# Altium project RadiationDetector.PrjPcb (part 2 of 5)

## Sheet Scintillator_Circuit.SchDoc
size A4; CheckedBy: Sr. Andrés Roldán; Address1: Avda. Madrid 28, Edif. I+D Josefina Castro Vizoso,  2ª planta 18012 - GRANADA, SPAIN; SheetNumber: 3; SheetTotal: 6
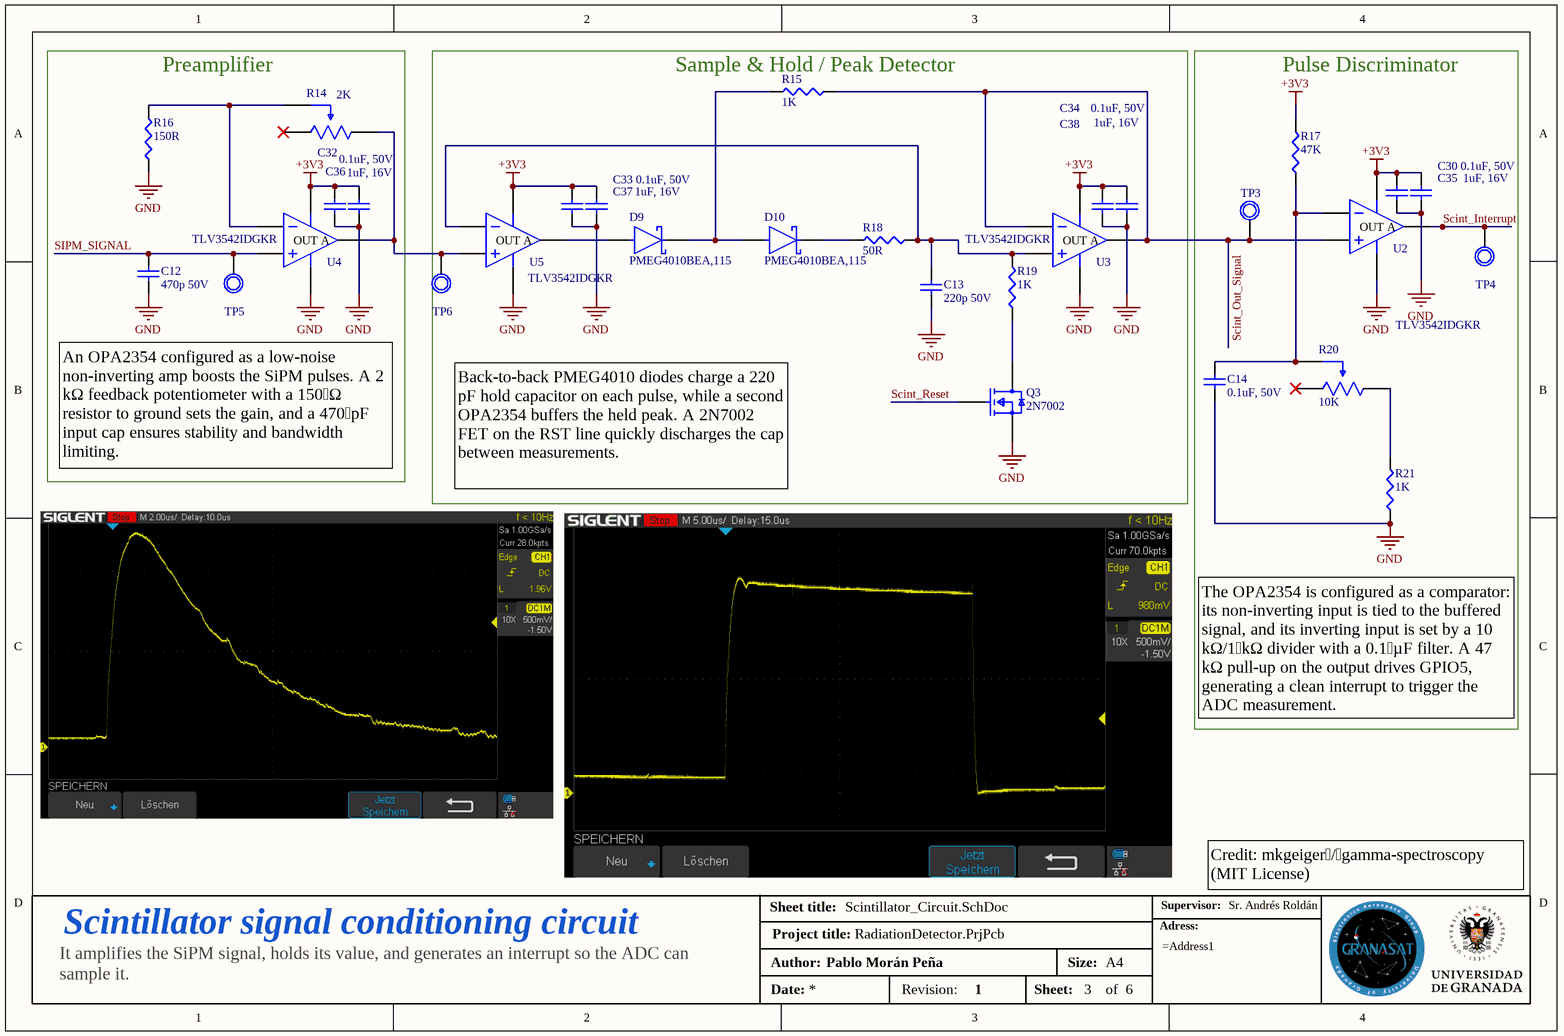
[diagram p2: Scintillator_Circuit.SchDoc]

### Parts
C12  470p 50V  [CAP 0402_1005]
C13  220p 50V  [CAP 0402_1005]
C14  0.1uF, 50V  [CAP 0402_1005]
C30  0.1uF, 50V  [CAP 0402_1005]
C32  0.1uF, 50V  [CAP 0402_1005]
C33  0.1uF, 50V  [CAP 0402_1005]
C34  0.1uF, 50V  [CAP 0402_1005]
C35  1uF, 16V  [CAP 0402_1005]
C36  1uF, 16V  [CAP 0402_1005]
C37  1uF, 16V  [CAP 0402_1005]
C38  1uF, 16V  [CAP 0402_1005]
D9  PMEG4010BEA,115  [SOD2512X110N]
D10  PMEG4010BEA,115  [SOD2512X110N]
Q3  2N7002  [SOT95P240X111-3N]
R14  2K  [TRIM_3314J-1-202E]
R15  1K  [RESC1005X37N]
R16  150R  [RESC1005X37N]
R17  47K  [RESC1005X37N]
R18  50R  [RESC1005X37N]
R19  1K  [RESC1005X37N]
R20  10K  [TS53YL_VIS]
R21  1K  [RESC1005X37N]
TP3  Testpoint  [Testpoint]  (value not drawn)  (no BOM)
TP4  Testpoint  [Testpoint]  (value not drawn)  (no BOM)
TP5  Testpoint  [Testpoint]  (value not drawn)  (no BOM)
TP6  Testpoint  [Testpoint]  (value not drawn)  (no BOM)
U2  TLV3542IDGKR  [DGK0008A_M]
U3  TLV3542IDGKR  [DGK0008A_M]
U4  TLV3542IDGKR  [DGK0008A_M]
U5  TLV3542IDGKR  [DGK0008A_M]

### Blocks framed on the sheet
Preamplifier: C12 C32 C36 R14 R16 TP5 U4
Sample & Hold / Peak Detector: C13 C33 C34 C37 C38 D9 D10 Q3 R15 R18 R19 TP6 U3 U5
Pulse Discriminator: C14 C30 C35 R17 R20 R21 TP3 TP4 U2

### Nets
+3V3: C30.2 C32.2 C33.2 C34.2 C35.2 C36.2 C37.2 C38.2 R17.2 U2.7(V+) U3.7(V+) U4.7(V+) U5.7(V+)
GND: C12.1 C13.1 C14.1 C30.1 C32.1 C33.1 C34.1 C35.1 C36.1 C37.1 C38.1 Q3.2(S) R16.1 R21.1 U2.4(V-) U3.4(V-) U4.4(V-) U5.4(V-)
Scint_Interrupt: TP4.1 U2.6(OUT_A)
Scint_Out_Signal: R15.2 TP3.1 U2.3(IN_A+) U3.2(IN_A-) U3.6(OUT_A)
Scint_Reset: Q3.1(G)
SIPM_SIGNAL: C12.2 TP5.1 U4.3(IN_A+)
NetC13_2: C13.2 R18.2 R19.2 U3.3(IN_A+) U5.2(IN_A-)
NetC14_2: C14.2 R17.1 R20.2(WIPER) U2.2(IN_A-)
NetD9_1: D9.1(C) D10.2(A) R15.1
NetD9_2: D9.2(A) U5.6(OUT_A)
NetD10_1: D10.1(C) R18.1
NetQ3_3: Q3.3(D) R19.1
NetR14_2: R14.2(WIPER) R16.2 U4.2(IN_A-)
NetR14_3: R14.3(CW) TP6.1 U4.6(OUT_A) U5.3(IN_A+)
NetR20_3: R20.3(CW) R21.2

Not connected (* = marked no-connect by the designer): R14 1(CCW)*; R20 1(CCW)*

### Notes on the sheet
- An OPA2354 configured as a low‑noise non‑inverting amp boosts the SiPM pulses. A 2 kΩ feedback potentiometer with a 150 Ω resistor to ground sets the gain, and a 470 pF input cap ensures stability and bandwidth limiting.
- Back‑to‑back PMEG4010 diodes charge a 220 pF hold capacitor on each pulse, while a second OPA2354 buffers the held peak. A 2N7002 FET on the RST line quickly discharges the cap between measurements.
- The OPA2354 is configured as a comparator: its non‑inverting input is tied to the buffered signal, and its inverting input is set by a 10 kΩ/1 kΩ divider with a 0.1 µF filter. A 47 kΩ pull‑up on the output drives GPIO5, generating a clean interrupt to trigger the ADC measurement.
- Sheet title:
- Supervisor:
- Credit: mkgeiger / gamma‑spectroscopy (MIT License)
- Scintillator signal conditioning circuit
- Author:
- Project title:
- Size:
- A4
- Adress:
- It amplifies the SiPM signal, holds its value, and generates an interrupt so the ADC can sample it.
- Date:
- Revision:
- Sheet:
- of

### Library data of the parts
C12 = CL05B471KB5VPNC: CAP CER 470PF 50V X7R 0402; Manufacturer: Samsung; Dielectric Material: Ceramic; Multilayer: Yes; Tolerance  (fill in as +-): 10%; Reference Standard: AEC-Q200; Supplier: Digikey; Supplier Part Number: 1276-6586-1-ND; Manufacturer Part Number: CL05B471KB5VPNC; RoHS: Yes; Category: Ceramic Capacitors; Stock: 5716; Pricing: 1=0,1, 10=0,031, 100=0,0179, 1000=0,01119, 2500=0,00885, 5000=0,00853 (USD); Mounting Technology: Surface Mount; Pins: 2; Package Shape: Rectangular; Case/Package: 0402; Terminal Finish: Nickel; Min Operating Temperature: -55°C; Max Operating Temperature: 125°C; JESD-609 Code: e3; Value: 470pF; Capacitor Type: Ceramic; Packaging: Tape and Reel; Tolerance (fill in as +-): 10%; Rated DC Voltage (URdc): 50V; Temperature Characteristics Code: X7R; Termination: Wraparound; Reach SVHC Compliant: Yes; RoHS Compliant: Yes; ComponentLink1URL: https://datasheet.ciiva.com:443/pdfs/VipMasterIC/IC/SEMS/SEMS-S-A0005596039/SEMS-S-A0005588397-1.pdf?src-supplier=IHS+Markit; ComponentLink1Description: https://datasheet.ciiva.com:443/pdfs/VipMasterIC/IC/SEMS/SEMS-S-A0005596039/SEMS-S-A0005588397-1.pdf?src-supplier=IHS+Markit; ComponentLink2URL: http://www.samsungsem.com/kr/support/product-search/mlcc/CL05B471KB5VPNC.jsp?src-supplier=Digikey; ComponentLink2Description: http://www.samsungsem.com/kr/support/product-search/mlcc/CL05B471KB5VPNC.jsp?src-supplier=Digikey; ComponentLink3URL: http://www.samsungsem.com/servlet/FileDownload?type=spec&file=CL05B471KB5VPNC.pdf&src-supplier=Avnet; ComponentLink3Description: http://www.samsungsem.com/servlet/FileDownload?type=spec&file=CL05B471KB5VPNC.pdf&src-supplier=Avnet; ComponentLink4URL: https://datasheet.octopart.com/CL05B471KB5VPNC-Samsung-Electro-Mechanics-datasheet-110326788.pdf?src-supplier=Future+Electronics; ComponentLink4Description: https://datasheet.octopart.com/CL05B471KB5VPNC-Samsung-Electro-Mechanics-datasheet-110326788.pdf?src-supplier=Future+Electronics; LCSC Part Number: C472438
C13 = CL05B221KB5NNNC: CAP CER 220PF 50V X7R 0402; Manufacturer: Samsung; Dielectric Material: Ceramic; Multilayer: Yes; Tolerance  (fill in as +-): 10%; Supplier: Digikey; Supplier Part Number: 1276-1531-1-ND; Manufacturer Part Number: CL05B221KB5NNNC; RoHS: Yes; Category: Ceramic Capacitors; Stock: 59270; Pricing: 1=0,1, 10=0,019, 100=0,0104, 1000=0,00621, 2500=0,00466, 5000=0,00442 (USD); Mounting Technology: Surface Mount; Pins: 2; Package Shape: Rectangular; Case/Package: 0402; Terminal Finish: Nickel; Min Operating Temperature: -55°C; Max Operating Temperature: 125°C; JESD-609 Code: e3; Value: 220pF; Capacitor Type: Ceramic; Package Style: SMTMeter; Packaging: Tape and Reel; Tolerance (fill in as +-): 10%; Rated DC Voltage (URdc): 50V; Temperature Characteristics Code: X7R; Termination: Wraparound; Length: 1mm; Width: 0.5mm; Height: 0.55mm; Reach SVHC Compliant: Yes; RoHS Compliant: Yes; ComponentLink1URL: https://datasheet.ciiva.com:443/pdfs/VipMasterIC/IC/SEMS/SEMS-S-A0008384515/SEMS-S-A0008872887-1.pdf?src-supplier=IHS+Markit; ComponentLink1Description: https://datasheet.ciiva.com:443/pdfs/VipMasterIC/IC/SEMS/SEMS-S-A0008384515/SEMS-S-A0008872887-1.pdf?src-supplier=IHS+Markit; ComponentLink2URL: https://datasheet.ciiva.com/25806/cl05b221kb5nnnc-25806724.pdf?src-supplier=Digikey; ComponentLink2Description: https://datasheet.ciiva.com/25806/cl05b221kb5nnnc-25806724.pdf?src-supplier=Digikey; ComponentLink3URL: https://datasheet.ciiva.com/26838/getdatasheetpartid-359684-26838219.pdf?src-supplier=Verical; ComponentLink3Description: https://datasheet.ciiva.com/26838/getdatasheetpartid-359684-26838219.pdf?src-supplier=Verical; ComponentLink4URL: https://datasheet.ciiva.com/16449/cl05b221kb5nnnc-16449133.pdf?src-supplier=Future+Electronics; ComponentLink4Description: https://datasheet.ciiva.com/16449/cl05b221kb5nnnc-16449133.pdf?src-supplier=Future+Electronics; ComponentLink5URL: https://datasheet.ciiva.com/26309/mlcc-catalogdownload2013-eng-26309018.pdf?src-supplier=Distrelec; ComponentLink5Description: https://datasheet.ciiva.com/26309/mlcc-catalogdownload2013-eng-26309018.pdf?src-supplier=Distrelec; LCSC Part Number: C296710
C14 C30 C32-C34 = CL05B104KB5NNNC: CAP CER 0.1UF 50V X7R 0402; Manufacturer: Samsung; Dielectric Material: Ceramic; Value: 100nF; Multilayer: Yes; Tolerance  (fill in as +-): 10%; Supplier: Avnet; Supplier Part Number: CL05B104KB5NNNC; Manufacturer Part Number: CL05B104KB5NNNC; RoHS: Yes; Category: Ceramic Capacitors; Pricing: 100000=0,00598, 120000=0,00595, 220000=0,00592, 500000=0,00589, 1000000=0,00586 (USD); Mounting Technology: Surface Mount; Pins: 2; Package Shape: Rectangular; Case/Package: 0402; Terminal Finish: Nickel; Min Operating Temperature: -55°C; Max Operating Temperature: 125°C; JESD-609 Code: e3; Capacitor Type: Ceramic; Packaging: Tape and Reel; Tolerance (fill in as +-): 10%; Rated DC Voltage (URdc): 50V; Temperature Characteristics Code: X7R; Termination: Wraparound; Reach SVHC Compliant: Yes; RoHS Compliant: Yes; ComponentLink1URL: https://datasheet.ciiva.com:443/pdfs/VipMasterIC/IC/SEMS/SEMS-S-A0008523115/SEMS-S-A0008523176-1.pdf?src-supplier=IHS+Markit; ComponentLink1Description: https://datasheet.ciiva.com:443/pdfs/VipMasterIC/IC/SEMS/SEMS-S-A0008523115/SEMS-S-A0008523176-1.pdf?src-supplier=IHS+Markit; ComponentLink2URL: https://datasheet.octopart.com/CL05B104KB5NNNC-Samsung-datasheet-97040617.pdf?src-supplier=Future+Electronics; ComponentLink2Description: https://datasheet.octopart.com/CL05B104KB5NNNC-Samsung-datasheet-97040617.pdf?src-supplier=Future+Electronics; ComponentLink3URL: https://datasheet.octopart.com/CL05B104KB5NNNC-Samsung-datasheet-8326407.pdf?src-supplier=TME; ComponentLink3Description: https://datasheet.octopart.com/CL05B104KB5NNNC-Samsung-datasheet-8326407.pdf?src-supplier=TME; LCSC Part Number: C960916
C35-C38 = CL05A105KO5NNNC: CAP CER 1UF 16V X5R 0402; Manufacturer: Samsung Electro-Mechanics; Dielectric Material: Ceramic; Multilayer: Yes; Tolerance  (fill in as +-): 10%; Supplier: Digikey; Supplier Part Number: 1276-1067-1-ND; Manufacturer Part Number: CL05A105KO5NNNC; Category: Ceramic Capacitors; Stock: 655135; Pricing: 1=0,08, 10=0,014, 100=0,0104, 1000=0,0072, 2500=0,0064 (USD); Mounting Technology: Surface Mount; Pins: 2; Package Shape: Rectangular; Case/Package: 0402; Terminal Finish: Nickel; Min Operating Temperature: -55°C; Max Operating Temperature: 85°C; JESD-609 Code: e3; Value: 1uF; Capacitor Type: Ceramic; Package Style: SMTMeter; Packaging: Tape and Reel; Tolerance (fill in as +-): 10%; Rated DC Voltage (URdc): 16V; Temperature Characteristics Code: X5R; Termination: Wraparound; Length: 1mm; Width: 0.5mm; Height: 0.55mm; Reach SVHC Compliant: Yes; RoHS Compliant: Yes; ComponentLink1URL: https://datasheet.ciiva.com:443/pdfs/VipMasterIC/IC/SEMS/SEMS-S-A0008384515/SEMS-S-A0008892675-1.pdf?src-supplier=IHS+Markit; ComponentLink1Description: https://datasheet.ciiva.com:443/pdfs/VipMasterIC/IC/SEMS/SEMS-S-A0008384515/SEMS-S-A0008892675-1.pdf?src-supplier=IHS+Markit; ComponentLink2URL: https://datasheet.octopart.com/CL05A105KO5NNNC-Samsung-Electro-Mechanics-datasheet-181960514.pdf?src-supplier=Farnell; ComponentLink2Description: https://datasheet.octopart.com/CL05A105KO5NNNC-Samsung-Electro-Mechanics-datasheet-181960514.pdf?src-supplier=Farnell; ComponentLink3URL: https://datasheet.octopart.com/CL05A105KO5NNNC-Samsung-Electro-Mechanics-datasheet-136031720.pdf?src-supplier=Samsung+SCT; ComponentLink3Description: https://datasheet.octopart.com/CL05A105KO5NNNC-Samsung-Electro-Mechanics-datasheet-136031720.pdf?src-supplier=Samsung+SCT; ComponentLink4URL: https://datasheet.octopart.com/CL05A105KO5NNNC-Samsung-Electro-Mechanics-datasheet-110226202.pdf?src-supplier=Future+Electronics; ComponentLink4Description: https://datasheet.octopart.com/CL05A105KO5NNNC-Samsung-Electro-Mechanics-datasheet-110226202.pdf?src-supplier=Future+Electronics; ComponentLink5URL: https://datasheet.octopart.com/CL05A105KO5NNNC-Samsung-Electro-Mechanics-datasheet-81461590.pdf?src-supplier=Future+Electronics; ComponentLink5Description: https://datasheet.octopart.com/CL05A105KO5NNNC-Samsung-Electro-Mechanics-datasheet-81461590.pdf?src-supplier=Future+Electronics; ComponentLink6URL: https://datasheet.octopart.com/CL05A105KO5NNNC-Samsung-Electro-Mechanics-datasheet-149136633.pdf?src-supplier=Future+Electronics; ComponentLink6Description: https://datasheet.octopart.com/CL05A105KO5NNNC-Samsung-Electro-Mechanics-datasheet-149136633.pdf?src-supplier=Future+Electronics; ComponentLink7URL: https://datasheet.octopart.com/CL05A105KO5NNNC-Samsung-Electro-Mechanics-datasheet-97040617.pdf; ComponentLink7Description: https://datasheet.octopart.com/CL05A105KO5NNNC-Samsung-Electro-Mechanics-datasheet-97040617.pdf; ComponentLink8URL: https://datasheet.octopart.com/CL05A105KO5NNNC-Samsung-Electro-Mechanics-datasheet-8324245.pdf; ComponentLink8Description: https://datasheet.octopart.com/CL05A105KO5NNNC-Samsung-Electro-Mechanics-datasheet-8324245.pdf; ComponentLink9URL: https://datasheet.octopart.com/General-Multilayer-Ceramic-Capacitors-Samsung-datasheet-family-111.pdf; ComponentLink9Description: https://datasheet.octopart.com/General-Multilayer-Ceramic-Capacitors-Samsung-datasheet-family-111.pdf; ComponentLink10URL: https://datasheet.octopart.com/CL05A105KO5NNNC-Samsung-Electro-Mechanics-datasheet-11776774.pdf?src-supplier=Arrow+Electronics; ComponentLink10Description: https://datasheet.octopart.com/CL05A105KO5NNNC-Samsung-Electro-Mechanics-datasheet-11776774.pdf?src-supplier=Arrow+Electronics; ComponentLink11URL: https://datasheet.octopart.com/CL05A105KO5NNNC-Samsung-datasheet-97040617.pdf; ComponentLink11Description: https://datasheet.octopart.com/CL05A105KO5NNNC-Samsung-datasheet-97040617.pdf; ComponentLink12URL: https://datasheet.octopart.com/CL05A105KO5NNNC-Samsung-datasheet-8324245.pdf; ComponentLink12Description: https://datasheet.octopart.com/CL05A105KO5NNNC-Samsung-datasheet-8324245.pdf; ComponentLink13URL: https://datasheet.octopart.com/CL05A105KO5NNNC-Samsung-datasheet-42280519.pdf?src-supplier=Future+Electronics; ComponentLink13Description: https://datasheet.octopart.com/CL05A105KO5NNNC-Samsung-datasheet-42280519.pdf?src-supplier=Future+Electronics; ComponentLink14URL: https://datasheet.octopart.com/CL05A105KO5NNNC-Samsung-datasheet-34152987.pdf?src-supplier=Future+Electronics; ComponentLink14Description: https://datasheet.octopart.com/CL05A105KO5NNNC-Samsung-datasheet-34152987.pdf?src-supplier=Future+Electronics; ComponentLink15URL: https://datasheet.octopart.com/CL05A105KO5NNNC-Samsung-datasheet-11776774.pdf?src-supplier=Future+Electronics; ComponentLink15Description: https://datasheet.octopart.com/CL05A105KO5NNNC-Samsung-datasheet-11776774.pdf?src-supplier=Future+Electronics; ComponentLink16URL: https://datasheet.octopart.com/CL05A105KO5NNNC-Samsung-datasheet-8329584.pdf?src-supplier=Future+Electronics; ComponentLink16Description: https://datasheet.octopart.com/CL05A105KO5NNNC-Samsung-datasheet-8329584.pdf?src-supplier=Future+Electronics; ComponentLink17URL: https://datasheet.octopart.com/CL05A105KO5NNNC-Samsung-datasheet-59220082.pdf?src-supplier=TME; ComponentLink17Description: https://datasheet.octopart.com/CL05A105KO5NNNC-Samsung-datasheet-59220082.pdf?src-supplier=TME; LCSC Part Number: C29266
D9 D10 = PMEG4010BEA,115: DIODE SCHOTTKY 40V 1A SOD323; Manufacturer: Nexperia; Diode Element Material: SILICON; Package Body Material: Plastic; Diode Type: RECTIFIER; Number of Elements: 1; Time @ Peak Reflow Temperature-Max (s): 40s; Qualification Status: Not Qualified; Supplier: Digikey; Supplier Part Number: 1727-5211-1-ND; Manufacturer Part Number: PMEG4010BEA,115; RoHS: Yes; Category: Schottky Diodes; Stock: 84260; Pricing: 1=0,29, 10=0,171, 100=0,109, 500=0,09678, 1000=0,08581 (USD); Pins: 2; Package Shape: Rectangular; Terminal Finish: Tin; Max Operating Temperature: 150°C; JESD-609 Code: e3; JESD-30 Code: R-PDSO-G2; Moisture Sensitivity Level: 1; Max Output current: 1A; Package Style: SMALL OUTLINEMeter; Peak Reflow Temperature (Cel): 260°C; Surface Mount: Yes; Technology: SCHOTTKY; Terminal Form: Gull Wing; Terminal Position: DUAL; Reach SVHC Compliant: Yes; RoHS Compliant: Yes; ComponentLink1URL: https://datasheet.ciiva.com:443/pdfs/VipMasterIC/IC/PHGL/PHGLS19535/PHGLS19689-1.pdf?src-supplier=IHS+Markit; ComponentLink1Description: https://datasheet.ciiva.com:443/pdfs/VipMasterIC/IC/PHGL/PHGLS19535/PHGLS19689-1.pdf?src-supplier=IHS+Markit; ComponentLink2URL: http://www.farnell.com/datasheets/689588.pdf?src-supplier=Farnell; ComponentLink2Description: http://www.farnell.com/datasheets/689588.pdf?src-supplier=Farnell; ComponentLink3URL: https://datasheet.octopart.com/PMEG4010BEA%2C115-Nexperia-datasheet-142110124.pdf?src-supplier=Future+Electronics; ComponentLink3Description: https://datasheet.octopart.com/PMEG4010BEA%2C115-Nexperia-datasheet-142110124.pdf?src-supplier=Future+Electronics; ComponentLink4URL: https://datasheet.octopart.com/PMEG4010BEA%2C115-Nexperia-datasheet-180924740.pdf?src-supplier=Newark; ComponentLink4Description: https://datasheet.octopart.com/PMEG4010BEA%2C115-Nexperia-datasheet-180924740.pdf?src-supplier=Newark; LCSC Part Number: C36975
Q3 = 2N7002: MOSFET SOT23 N 60V 5OHM 150C; Manufacturer: ON Semiconductor / Fairchild; Package Body Material: Plastic; Transistor Element Material: SILICON; Polarity/Channel Type: N-CHANNEL; Drain Current-Max (ID): 115mA; Drain-source On Resistance-Max: 7.5R; Feedback Cap-Max (Crss): 5pF; FET Technology: METAL-OXIDE SEMICONDUCTOR; Number of Elements: 1; Operating Mode: ENHANCEMENT MODE; Power Dissipation-Max (Abs): 200mW; Transistor Application: SWITCHING; Qualification Status: Not Qualified; JEDEC-95 Code: TO-236AB; Supplier: Digikey; Supplier Part Number: 2N7002NCT-ND; Manufacturer Part Number: 2N7002; RoHS: Yes; Category: MOSFETs; Stock: 13333; Pricing: 1=0,49, 10=0,285, 100=0,1683, 500=0,16466, 1000=0,15124 (USD); Pins: 3; Package Shape: Rectangular; Terminal Finish: Tin; Max Operating Temperature: 150°C; JESD-609 Code: e3; DS Breakdown Voltage-Min: 60V; JESD-30 Code: R-PDSO-G3; Package Style: SMALL OUTLINEMeter; Surface Mount: Yes; Terminal Form: Gull Wing; Terminal Position: DUAL; Drain Current-Max (Abs) (ID): 115mA; Moisture Sensitivity Level: 1; RoHS Compliant: Yes; Reach SVHC Compliant: Yes; ComponentLink1URL: https://datasheet.ciiva.com:443/pdfs/VipMasterIC/IC/ONSM/ONSM-S-A0003544006/ONSM-S-A0003544006-1.pdf?src-supplier=IHS+Markit; ComponentLink1Description: https://datasheet.ciiva.com:443/pdfs/VipMasterIC/IC/ONSM/ONSM-S-A0003544006/ONSM-S-A0003544006-1.pdf?src-supplier=IHS+Markit; ComponentLink2URL: https://datasheet.ciiva.com/931/2n7000-931777.pdf?src-supplier=Farnell; ComponentLink2Description: https://datasheet.ciiva.com/931/2n7000-931777.pdf?src-supplier=Farnell; ComponentLink3URL: https://datasheet.ciiva.com/1254/2n7002-1254451.pdf?src-supplier=Newark; ComponentLink3Description: https://datasheet.ciiva.com/1254/2n7002-1254451.pdf?src-supplier=Newark; ComponentLink4URL: https://datasheet.ciiva.com/15137/getdatasheetpartid-93547-15137771.pdf?src-supplier=Verical; ComponentLink4Description: https://datasheet.ciiva.com/15137/getdatasheetpartid-93547-15137771.pdf?src-supplier=Verical; ComponentLink5URL: https://datasheet.ciiva.com/931/2n7000-931763.pdf?src-supplier=Digikey; ComponentLink5Description: https://datasheet.ciiva.com/931/2n7000-931763.pdf?src-supplier=Digikey; ComponentLink6URL: https://datasheet.ciiva.com/3304/nds7002a-3304381.pdf?src-supplier=Avnet; ComponentLink6Description: https://datasheet.ciiva.com/3304/nds7002a-3304381.pdf?src-supplier=Avnet; ComponentLink7URL: https://datasheet.ciiva.com/1188/660093-1188361.pdf?src-supplier=Element14; ComponentLink7Description: https://datasheet.ciiva.com/1188/660093-1188361.pdf?src-supplier=Element14; ComponentLink8URL: https://datasheet.ciiva.com/931/2n7000-931762.pdf?src-supplier=Digikey; ComponentLink8Description: https://datasheet.ciiva.com/931/2n7000-931762.pdf?src-supplier=Digikey; ComponentLink9URL: https://datasheet.ciiva.com/1254/660093-1254452.pdf?src-supplier=Newark; ComponentLink9Description: https://datasheet.ciiva.com/1254/660093-1254452.pdf?src-supplier=Newark; ComponentLink10URL: https://datasheet.ciiva.com/17007/2n7002-17007243.pdf?src-supplier=Future+Electronics; ComponentLink10Description: https://datasheet.ciiva.com/17007/2n7002-17007243.pdf?src-supplier=Future+Electronics; ComponentLink11URL: https://datasheet.ciiva.com/22655/660093-22655230.pdf?src-supplier=Element14; ComponentLink11Description: https://datasheet.ciiva.com/22655/660093-22655230.pdf?src-supplier=Element14; LCSC Part Number: C124475
R14 = 3314J-1-202E: TRIMMER 2K OHM 0.25W J LEAD TOP; Manufacturer: Bourns; Tolerance: 20%; Actuator Orientation: Vertical; Actuator Type: SCREW; Number of Turns: 1; Power: 250mW; Rated Temperature: 70°C; Value: 2kR; Resistance Law: Linear; Rotational Angle: 240°; Temperature Coefficient (ppm/Cel): -100,100; Package Height: 2.55mm; Package Length: 5mm; Package Width: 4.5mm; Supplier: Digikey; Supplier Part Number: 3314J-202ECT-ND; Manufacturer Part Number: 3314J-1-202E; RoHS: Yes; Category: Variable Resistors and Potentiometers; Stock: 7573; Pricing: 1=1,58, 10=1,335, 100=1,1219 (USD); Mounting Technology: Surface Mount; Pins: 3; Package Shape: Rectangular; Case/Package: 2018; Terminal Finish: Tin; Min Operating Temperature: -55°C; Max Operating Temperature: 125°C; JESD-609 Code: e3; Resistor Type: TRIMMER; Construction: Rectangular; Packaging: Tape and Reel; Technology: CERMET; Termination: J BEND; Reach SVHC Compliant: Yes; RoHS Compliant: Yes; ComponentLink1URL: https://datasheet.ciiva.com:443/pdfs/VipMasterIC/IC/BOUR/BOUR-S-A0008818047/BOUR-S-A0008818047-1.pdf?src-supplier=IHS+Markit; ComponentLink1Description: https://datasheet.ciiva.com:443/pdfs/VipMasterIC/IC/BOUR/BOUR-S-A0008818047/BOUR-S-A0008818047-1.pdf?src-supplier=IHS+Markit; ComponentLink2URL: https://datasheet.ciiva.com/6197/1770665-6197457.pdf?src-supplier=Farnell; ComponentLink2Description: https://datasheet.ciiva.com/6197/1770665-6197457.pdf?src-supplier=Farnell; ComponentLink3URL: https://datasheet.ciiva.com/11831/0900766b800302ec-11831929.pdf?src-supplier=Rs; ComponentLink3Description: https://datasheet.ciiva.com/11831/0900766b800302ec-11831929.pdf?src-supplier=Rs; ComponentLink4URL: https://datasheet.ciiva.com/2156/3314-2156300.pdf?src-supplier=Digikey; ComponentLink4Description: https://datasheet.ciiva.com/2156/3314-2156300.pdf?src-supplier=Digikey; ComponentLink5URL: https://datasheet.ciiva.com/2156/3314-2156301.pdf?src-supplier=Digikey; ComponentLink5Description: https://datasheet.ciiva.com/2156/3314-2156301.pdf?src-supplier=Digikey; ComponentLink6URL: https://datasheet.ciiva.com/2156/3314-2156302.pdf?src-supplier=Digikey; ComponentLink6Description: https://datasheet.ciiva.com/2156/3314-2156302.pdf?src-supplier=Digikey; ComponentLink7URL: https://datasheet.ciiva.com/3266/3314-3266277.pdf?src-supplier=Avnet; ComponentLink7Description: https://datasheet.ciiva.com/3266/3314-3266277.pdf?src-supplier=Avnet; ComponentLink8URL: https://datasheet.ciiva.com/30098/6393314-30098281.pdf?src-supplier=Onlinecomponents.com; ComponentLink8Description: https://datasheet.ciiva.com/30098/6393314-30098281.pdf?src-supplier=Onlinecomponents.com; ComponentLink9URL: https://datasheet.ciiva.com/1477/1846253-1477628.pdf?src-supplier=Element14; ComponentLink9Description: https://datasheet.ciiva.com/1477/1846253-1477628.pdf?src-supplier=Element14; ComponentLink10URL: https://datasheet.ciiva.com/22696/1846253-22696687.pdf?src-supplier=Element14; ComponentLink10Description: https://datasheet.ciiva.com/22696/1846253-22696687.pdf?src-supplier=Element14; ComponentLink11URL: https://datasheet.ciiva.com/48698/001055052-da-01-en-smd-trimm-3314j-1-202e-2k-ohm-0-25w-48698971.pdf?src-supplier=Conrad; ComponentLink11Description: https://datasheet.ciiva.com/48698/001055052-da-01-en-smd-trimm-3314j-1-202e-2k-ohm-0-25w-48698971.pdf?src-supplier=Conrad; LCSC Part Number: C94513
R15 R19 R21 = AC0402JR-071KL: RES SMD 1K OHM 5% 1/16W 0402; Manufacturer: Yageo; Additional Feature: LASER TRIMMABLE; Power: 62.5mW; Rated Temperature: 70°C; Value: 1kR; Working Voltage: 50V; Temperature Coefficient (ppm/Cel): 100; Package Height: 0.32mm; Package Length: 1mm; Package Width: 0.5mm; Reference Standard: AEC-Q200; Supplier: Digikey; Supplier Part Number: YAG3525CT-ND; Manufacturer Part Number: AC0402JR-071KL; RoHS: Yes; Category: Chip SMD Resistors; Stock: 135341; Pricing: 1=0,1, 10=0,007, 50=0,0066, 100=0,0061, 500=0,0051, 1000=0,00408 (USD); Mounting Technology: Surface Mount; Pins: 2; Package Shape: Rectangular; Case/Package: 0402; Terminal Finish: Nickel; Min Operating Temperature: -55°C; Max Operating Temperature: 155°C; Tolerance: 5%; JESD-609 Code: e3; Termination: Wraparound; Resistor Type: FIXED RESISTOR; Construction: Chip; Packaging: Tape and Reel; Technology: METAL GLAZE/THICK FILM; Reach SVHC Compliant: Yes; RoHS Compliant: Yes; ComponentLink1URL: https://datasheet.ciiva.com:443/pdfs/VipMasterIC/IC/YAGO/YAGO-S-A0003597364/YAGO-S-A0003597364-1.pdf?src-supplier=IHS+Markit; ComponentLink1Description: https://datasheet.ciiva.com:443/pdfs/VipMasterIC/IC/YAGO/YAGO-S-A0003597364/YAGO-S-A0003597364-1.pdf?src-supplier=IHS+Markit; ComponentLink2URL: https://datasheet.ciiva.com/12577/pyu-ac-51-rohs-l-2-12577195.pdf?src-supplier=Mouser; ComponentLink2Description: https://datasheet.ciiva.com/12577/pyu-ac-51-rohs-l-2-12577195.pdf?src-supplier=Mouser; LCSC Part Number: C138287
R16 = AC0402FR-07150RL: RES SMD 150 OHM 1% 1/16W 0402; Manufacturer: Yageo; Additional Feature: LASER TRIMMABLE; Power: 62.5mW; Rated Temperature: 70°C; Working Voltage: 50V; Temperature Coefficient (ppm/Cel): 100; Package Height: 0.32mm; Package Length: 1mm; Package Width: 0.5mm; Reference Standard: AEC-Q200; Supplier: Digikey; Supplier Part Number: YAG3443DKR-ND; Manufacturer Part Number: AC0402FR-07150RL; Category: Chip SMD Resistors; Stock: 72156; Pricing: 1=0,1, 10=0,009, 100=0,0071, 1000=0,00612, 2500=0,0051, 5000=0,00407 (USD); Mounting Technology: Surface Mount; Pins: 2; Package Shape: Rectangular; Case/Package: 0402; Terminal Finish: Nickel; Min Operating Temperature: -55°C; Max Operating Temperature: 155°C; Tolerance: 1%; JESD-609 Code: e3; Resistor Type: FIXED RESISTOR; Construction: Chip; Packaging: Tape and Reel; Value: 150R; Technology: METAL GLAZE/THICK FILM; Termination: Wraparound; Reach SVHC Compliant: Yes; RoHS Compliant: Yes; ComponentLink1URL: https://datasheet.ciiva.com:443/pdfs/VipMasterIC/IC/YAGO/YAGO-S-A0003597364/YAGO-S-A0003597364-1.pdf?src-supplier=IHS+Markit; ComponentLink1Description: https://datasheet.ciiva.com:443/pdfs/VipMasterIC/IC/YAGO/YAGO-S-A0003597364/YAGO-S-A0003597364-1.pdf?src-supplier=IHS+Markit; ComponentLink2URL: https://datasheet.ciiva.com/12576/pyu-ac-51-rohs-l-2-12576540.pdf?src-supplier=Mouser; ComponentLink2Description: https://datasheet.ciiva.com/12576/pyu-ac-51-rohs-l-2-12576540.pdf?src-supplier=Mouser; ComponentLink3URL: https://datasheet.octopart.com/AC0402FR-07150RL-Yageo-datasheet-83209224.pdf?src-supplier=Upverter; ComponentLink3Description: https://datasheet.octopart.com/AC0402FR-07150RL-Yageo-datasheet-83209224.pdf?src-supplier=Upverter; ComponentLink4URL: https://datasheet.octopart.com/AC0402FR-07150RL-Yageo-datasheet-178509465.pdf?src-supplier=Farnell; ComponentLink4Description: https://datasheet.octopart.com/AC0402FR-07150RL-Yageo-datasheet-178509465.pdf?src-supplier=Farnell; ComponentLink5URL: https://datasheet.octopart.com/AC0402FR-07150RL-Yageo-datasheet-12512238.pdf; ComponentLink5Description: https://datasheet.octopart.com/AC0402FR-07150RL-Yageo-datasheet-12512238.pdf; ComponentLink6URL: https://datasheet.octopart.com/AC0402FR-07150RL-Yageo-datasheet-166720450.pdf?src-supplier=Future+Electronics; ComponentLink6Description: https://datasheet.octopart.com/AC0402FR-07150RL-Yageo-datasheet-166720450.pdf?src-supplier=Future+Electronics; ComponentLink7URL: https://datasheet.octopart.com/AC0402FR-07150RL-Yageo-datasheet-151884373.pdf?src-supplier=Future+Electronics; ComponentLink7Description: https://datasheet.octopart.com/AC0402FR-07150RL-Yageo-datasheet-151884373.pdf?src-supplier=Future+Electronics; ComponentLink8URL: https://datasheet.octopart.com/AC0402FR-07150RL-Yageo-datasheet-137699919.pdf?src-supplier=Future+Electronics; ComponentLink8Description: https://datasheet.octopart.com/AC0402FR-07150RL-Yageo-datasheet-137699919.pdf?src-supplier=Future+Electronics; ComponentLink9URL: https://datasheet.octopart.com/AC0402FR-07150RL-Yageo-datasheet-24580492.pdf?src-supplier=Future+Electronics; ComponentLink9Description: https://datasheet.octopart.com/AC0402FR-07150RL-Yageo-datasheet-24580492.pdf?src-supplier=Future+Electronics; ComponentLink10URL: https://datasheet.octopart.com/AC0402FR-07150RL-Yageo-datasheet-13029202.pdf?src-supplier=Future+Electronics; ComponentLink10Description: https://datasheet.octopart.com/AC0402FR-07150RL-Yageo-datasheet-13029202.pdf?src-supplier=Future+Electronics; ComponentLink11URL: https://datasheet.octopart.com/AC0402FR-07150RL-Yageo-datasheet-140571090.pdf?src-supplier=Arrow.cn; ComponentLink11Description: https://datasheet.octopart.com/AC0402FR-07150RL-Yageo-datasheet-140571090.pdf?src-supplier=Arrow.cn; LCSC Part Number: C226790
R17 = AC0402FR-0747KL: RES SMD 47K OHM 1% 1/16W 0402; Manufacturer: Yageo; Additional Feature: LASER TRIMMABLE; Power: 62.5mW; Rated Temperature: 70°C; Value: 47kR; Working Voltage: 50V; Temperature Coefficient (ppm/Cel): 100; Package Height: 0.32mm; Package Length: 1mm; Package Width: 0.5mm; Reference Standard: AEC-Q200; Supplier: Digikey; Supplier Part Number: YAG3490CT-ND; Manufacturer Part Number: AC0402FR-0747KL; RoHS: Yes; Category: Chip SMD Resistors; Stock: 187655; Pricing: 1=0,1, 10=0,011, 100=0,0082, 1000=0,00612, 2500=0,0051, 5000=0,00407 (USD); Mounting Technology: Surface Mount; Pins: 2; Package Shape: Rectangular; Case/Package: 0402; Terminal Finish: Nickel; Min Operating Temperature: -55°C; Max Operating Temperature: 155°C; Tolerance: 1%; JESD-609 Code: e3; Resistor Type: FIXED RESISTOR; Construction: Chip; Packaging: Tape and Reel; Technology: METAL GLAZE/THICK FILM; Termination: Wraparound; Reach SVHC Compliant: Yes; RoHS Compliant: Yes; ComponentLink1URL: https://datasheet.ciiva.com:443/pdfs/VipMasterIC/IC/YAGO/YAGO-S-A0003597364/YAGO-S-A0003597364-1.pdf?src-supplier=IHS+Markit; ComponentLink1Description: https://datasheet.ciiva.com:443/pdfs/VipMasterIC/IC/YAGO/YAGO-S-A0003597364/YAGO-S-A0003597364-1.pdf?src-supplier=IHS+Markit; ComponentLink2URL: https://datasheet.ciiva.com/12576/pyu-ac-51-rohs-l-2-12576549.pdf?src-supplier=Mouser; ComponentLink2Description: https://datasheet.ciiva.com/12576/pyu-ac-51-rohs-l-2-12576549.pdf?src-supplier=Mouser; LCSC Part Number: C144757
R18 = RT0402BRE0750RL: RES SMD 50 OHM 0.1% 1/16W 0402; Manufacturer: Yageo; Additional Feature: LASER TRIMMABLE; Power: 62.5mW; Rated Temperature: 70°C; Working Voltage: 50V; Temperature Coefficient (ppm/Cel): 50; Supplier: Digikey; Supplier Part Number: 13-RT0402BRE0750RLCT-ND; Manufacturer Part Number: RT0402BRE0750RL; RoHS: Yes; Category: Chip SMD Resistors; Stock: 6180; Pricing: 1=0,18, 10=0,133, 50=0,1072, 100=0,0959, 500=0,0765, 1000=0,06834, 5000=0,05406 (USD); Mounting Technology: Surface Mount; Pins: 2; Package Shape: Rectangular; Case/Package: 0402; Min Operating Temperature: -55°C; Max Operating Temperature: 155°C; Tolerance: 0.1%; Resistor Type: FIXED RESISTOR; Packaging: Tape and Reel; Value: 50R; Technology: THIN FILM; Termination: Wraparound; Reach SVHC Compliant: Yes; RoHS Compliant: Yes; ComponentLink1URL: https://datasheet.ciiva.com:443/pdfs/VipMasterIC/IC/YAGO/YAGO-S-A0003507815/YAGO-S-A0003507815-1.pdf?src-supplier=IHS+Markit; ComponentLink1Description: https://datasheet.ciiva.com:443/pdfs/VipMasterIC/IC/YAGO/YAGO-S-A0003507815/YAGO-S-A0003507815-1.pdf?src-supplier=IHS+Markit; ComponentLink2URL: http://www.yageo.com/documents/recent/PYu-RT_1-to-0.01_RoHS_L_9.pdf?src-supplier=Digikey; ComponentLink2Description: http://www.yageo.com/documents/recent/PYu-RT_1-to-0.01_RoHS_L_9.pdf?src-supplier=Digikey; ComponentLink3URL: https://datasheet.octopart.com/RT0402BRE0750RL-Yageo-datasheet-166250672.pdf?src-supplier=Future+Electronics; ComponentLink3Description: https://datasheet.octopart.com/RT0402BRE0750RL-Yageo-datasheet-166250672.pdf?src-supplier=Future+Electronics; ComponentLink4URL: https://datasheet.octopart.com/RT0402BRE0750RL-Yageo-datasheet-176402239.pdf?src-supplier=Farnell; ComponentLink4Description: https://datasheet.octopart.com/RT0402BRE0750RL-Yageo-datasheet-176402239.pdf?src-supplier=Farnell; ComponentLink5URL: https://datasheet.octopart.com/RT0402BRE0750RL-Yageo-datasheet-176402239.pdf?src-supplier=Element14; ComponentLink5Description: https://datasheet.octopart.com/RT0402BRE0750RL-Yageo-datasheet-176402239.pdf?src-supplier=Element14; LCSC Part Number: C853312
R20 = TS53YL103MR10: TRIMMER 10K OHM 0.25W GW TOP ADJ; Manufacturer: Vishay; Tolerance: 20%; Actuator Orientation: Vertical; Actuator Type: SCREW; Number of Turns: 1; Power: 250mW; Rated Temperature: 70°C; Value: 10kR; Resistance Law: Linear; Rotational Angle: 220°; Working Voltage: 50V; Temperature Coefficient (ppm/Cel): -100,100; Package Height: 2.7mm; Package Length: 5mm; Supplier: Digikey; Supplier Part Number: TS53YL-10KCT-ND; Manufacturer Part Number: TS53YL103MR10; RoHS: Yes; Category: Variable Resistors and Potentiometers; Stock: 947; Pricing: 1=2,72, 10=2,29, 100=1,9223 (USD); Mounting Technology: Surface Mount; Pins: 3; Package Shape: Rectangular; Case/Package: 2020; Terminal Finish: Tin; Min Operating Temperature: -55°C; Max Operating Temperature: 125°C; JESD-609 Code: e3; Resistor Type: TRIMMER; Construction: Trimmer; Packaging: Tape and Reel; Technology: CERMET; Termination: Gull Wing; Package Width: 5mm; Reach SVHC Compliant: Yes; RoHS Compliant: Yes; ComponentLink1URL: https://datasheet.ciiva.com:443/pdfs/VipMasterIC/IC/VISH/VISH-S-A0007084328/VISH-S-A0007084328-1.pdf?src-supplier=IHS+Markit; ComponentLink1Description: https://datasheet.ciiva.com:443/pdfs/VipMasterIC/IC/VISH/VISH-S-A0007084328/VISH-S-A0007084328-1.pdf?src-supplier=IHS+Markit; ComponentLink2URL: https://datasheet.ciiva.com/11831/0900766b80442f56-11831494.pdf?src-supplier=Rs; ComponentLink2Description: https://datasheet.ciiva.com/11831/0900766b80442f56-11831494.pdf?src-supplier=Rs; ComponentLink3URL: https://datasheet.ciiva.com/2156/ts53y-2156140.pdf?src-supplier=Digikey; ComponentLink3Description: https://datasheet.ciiva.com/2156/ts53y-2156140.pdf?src-supplier=Digikey; ComponentLink4URL: https://datasheet.ciiva.com/2156/ts53y-2156141.pdf?src-supplier=Digikey; ComponentLink4Description: https://datasheet.ciiva.com/2156/ts53y-2156141.pdf?src-supplier=Digikey; ComponentLink5URL: https://datasheet.ciiva.com/2156/ts53y-2156142.pdf?src-supplier=Digikey; ComponentLink5Description: https://datasheet.ciiva.com/2156/ts53y-2156142.pdf?src-supplier=Digikey; ComponentLink6URL: https://datasheet.ciiva.com/16716/70218802-16716550.pdf?src-supplier=Allied+Electronics; ComponentLink6Description: https://datasheet.ciiva.com/16716/70218802-16716550.pdf?src-supplier=Allied+Electronics; ComponentLink7URL: https://datasheet.ciiva.com/8021/1696501-8021141.pdf?src-supplier=Element14; ComponentLink7Description: https://datasheet.ciiva.com/8021/1696501-8021141.pdf?src-supplier=Element14; LCSC Part Number: C5189226
U2-U5 = TLV3542IDGKR: 200MHz Rail-to-Rail I/O, CMOS Operational Amplifier for Cost-Sensitive Systems; Manufacturer: Texas Instruments; Manufacturer Part Number: OPA2354AIDGKR; Package Body Material: Plastic; Bandwidth-Nom: 250MHz; Consumer IC Type: VIDEO AMPLIFIER; Number of Channels: 1; Channels: 2; Max Supply Voltage: 2.75V; Min Supply Voltage: 1.25V; Qualification Status: Not Qualified; Supplier: Digikey; Supplier Part Number: 296-12642-2-ND; RoHS: Yes; Category: Amplifiers - Op Amps, Buffer, Instrumentation; Stock: 1940; Pricing: 2500=1,67764, 5000=1,64498 (USD); Case/Package: TSSOP; Pins: 8; Package Shape: Square; Terminal Finish: Nickel; Min Operating Temperature: -40°C; Max Operating Temperature: 125°C; JESD-609 Code: e4; JESD-30 Code: S-PDSO-G8; Moisture Sensitivity Level: 2; Package Style: SMALL OUTLINE, HEAT SINK/SLUG, THIN PROFILE, SHRINK PITCHMeter; Peak Reflow Temperature (Cel): 260°C; Surface Mount: Yes; Technology: CMOS; Terminal Form: Gull Wing; Terminal Position: DUAL; Length: 3mm; Width: 3mm; Height - Seated (Max): 1.1mm; Terminal Pitch: 0.65mm; Reach SVHC Compliant: Yes; RoHS Compliant: Yes; Temperature Grade: AUTOMOTIVE; ComponentLink1URL: https://www.ti.com:443/lit/ds/symlink/opa2354.pdf?src-supplier=IHS+Markit; ComponentLink1Description: https://www.ti.com:443/lit/ds/symlink/opa2354.pdf?src-supplier=IHS+Markit; ComponentLink2URL: https://datasheet.ciiva.com/1798/opa354-1798288.pdf?src-supplier=Digikey; ComponentLink2Description: https://datasheet.ciiva.com/1798/opa354-1798288.pdf?src-supplier=Digikey; ComponentLink3URL: https://datasheet.ciiva.com/23838/opa2354-23838874.pdf?src-supplier=Newark; ComponentLink3Description: https://datasheet.ciiva.com/23838/opa2354-23838874.pdf?src-supplier=Newark; ComponentLink4URL: https://datasheet.ciiva.com/1798/opa354-1798289.pdf?src-supplier=Digikey; ComponentLink4Description: https://datasheet.ciiva.com/1798/opa354-1798289.pdf?src-supplier=Digikey; ComponentLink5URL: https://datasheet.ciiva.com/1798/opa354-1798290.pdf?src-supplier=Digikey; ComponentLink5Description: https://datasheet.ciiva.com/1798/opa354-1798290.pdf?src-supplier=Digikey; ComponentLink6URL: https://datasheet.ciiva.com/14456/sbos233e-14456446.pdf?src-supplier=Avnet; ComponentLink6Description: https://datasheet.ciiva.com/14456/sbos233e-14456446.pdf?src-supplier=Avnet; LCSC Part Number: C2876465

## Sheet Peripherals.SchDoc
size A4; CheckedBy: Sr. Andrés Roldán; Address1: Avda. Madrid 28, Edif. I+D Josefina Castro Vizoso,  2ª planta 18012 - GRANADA, SPAIN; SheetNumber: 4; SheetTotal: 6
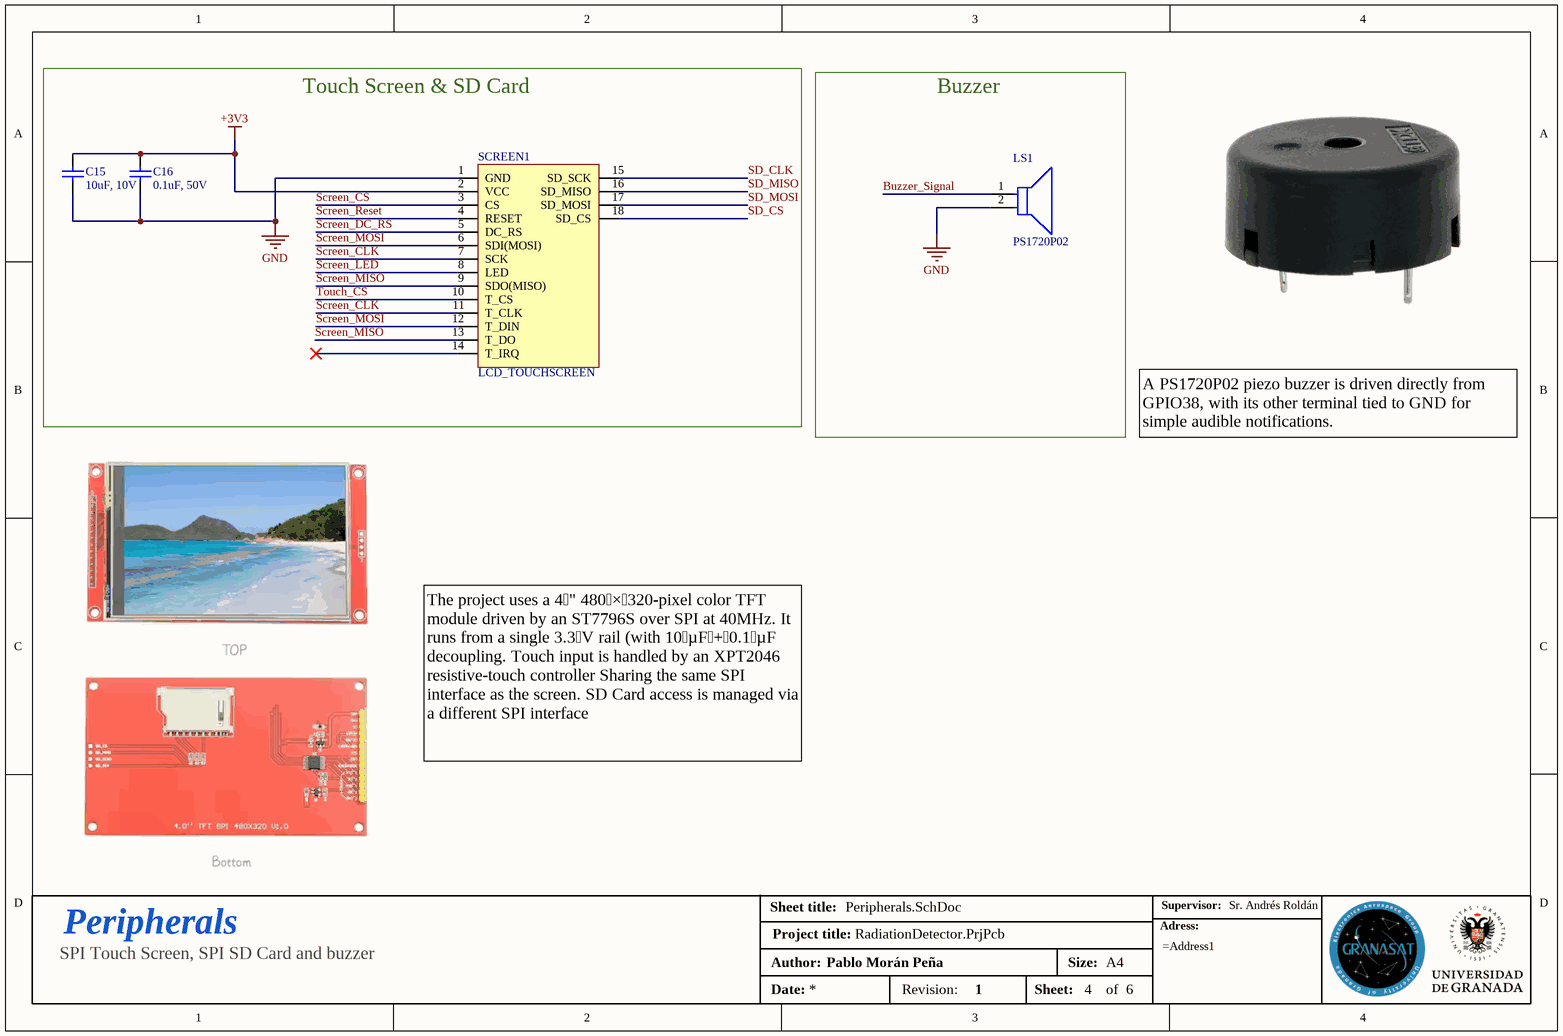
[diagram p3: Peripherals.SchDoc]

### Parts
C15  10uF, 10V  [CAP 0402_1005]
C16  0.1uF, 50V  [CAP 0402_1005]
LS1  PS1720P02  [FP-PS1720P02-MFG]
SCREEN1  LCD_TOUCHSCREEN  [LCD_TouchScreen]

### Blocks framed on the sheet
Touch Screen & SD Card: C15 C16 SCREEN1
Buzzer: LS1

### Nets
+3V3: C15.2 C16.2 SCREEN1.2(VCC)
GND: C15.1 C16.1 LS1.2 SCREEN1.1(GND)
Buzzer_Signal: LS1.1
Screen_CLK: SCREEN1.7(SCK) SCREEN1.11(T_CLK)
Screen_CS: SCREEN1.3(CS)
Screen_DC_RS: SCREEN1.5(DC_RS)
Screen_LED: SCREEN1.8(LED)
Screen_MISO: SCREEN1.9(SDO(MISO)) SCREEN1.13(T_DO)
Screen_MOSI: SCREEN1.6(SDI(MOSI)) SCREEN1.12(T_DIN)
Screen_Reset: SCREEN1.4(RESET)
SD_CLK: SCREEN1.15(SD_SCK)
SD_CS: SCREEN1.18(SD_CS)
SD_MISO: SCREEN1.16(SD_MISO)
SD_MOSI: SCREEN1.17(SD_MOSI)
Touch_CS: SCREEN1.10(T_CS)

Not connected (* = marked no-connect by the designer): SCREEN1 14(T_IRQ)*

### Notes on the sheet
- A PS1720P02 piezo buzzer is driven directly from GPIO38, with its other terminal tied to GND for simple audible notifications.
- The project uses a 4 " 480 × 320‑pixel color TFT module driven by an ST7796S over SPI at 40MHz. It runs from a single 3.3 V rail (with 10 µF + 0.1 µF decoupling. Touch input is handled by an XPT2046 resistive‑touch controller Sharing the same SPI interface as the screen. SD Card access is managed via a different SPI interface
- Sheet title:
- Supervisor:
- Peripherals
- Author:
- Project title:
- Size:
- A4
- Adress:
- SPI Touch Screen, SPI SD Card and buzzer
- Date:
- Revision:
- Sheet:
- of

### Library data of the parts
C15 = CL05A106MP8NUB8: CAP CER 10UF 10V X5R 0402; Manufacturer: Samsung Electro-Mechanics; Dielectric Material: Ceramic; Multilayer: Yes; Tolerance  (fill in as +-): 20%; Supplier: Digikey; Supplier Part Number: 1276-6830-1-ND; Manufacturer Part Number: CL05A106MP8NUB8; Category: Ceramic Capacitors; Stock: 145439; Pricing: 1=0,2, 10=0,12, 100=0,0808, 1000=0,0568 (USD); Mounting Technology: Surface Mount; Pins: 2; Package Shape: Rectangular; Case/Package: 0402; Terminal Finish: Nickel; Min Operating Temperature: -55°C; Max Operating Temperature: 85°C; JESD-609 Code: e3; Value: 10uF; Capacitor Type: Ceramic; Packaging: Tape and Reel; Tolerance (fill in as +-): 20%; Rated DC Voltage (URdc): 10V; Temperature Characteristics Code: X5R; Termination: Wraparound; Reach SVHC Compliant: Yes; RoHS Compliant: Yes; ComponentLink1URL: https://datasheet.ciiva.com:443/pdfs/VipMasterIC/IC/SEMS/SEMS-S-A0008521219/SEMS-S-A0008521325-1.pdf?src-supplier=IHS+Markit; ComponentLink1Description: https://datasheet.ciiva.com:443/pdfs/VipMasterIC/IC/SEMS/SEMS-S-A0008521219/SEMS-S-A0008521325-1.pdf?src-supplier=IHS+Markit; ComponentLink2URL: https://datasheet.octopart.com/CL05A106MP8NUB8-Samsung-Electro-Mechanics-datasheet-181551178.pdf?src-supplier=Farnell; ComponentLink2Description: https://datasheet.octopart.com/CL05A106MP8NUB8-Samsung-Electro-Mechanics-datasheet-181551178.pdf?src-supplier=Farnell; ComponentLink3URL: https://datasheet.octopart.com/CL05A106MP8NUB8-Samsung-Electro-Mechanics-datasheet-141346815.pdf?src-supplier=Samsung+SCT; ComponentLink3Description: https://datasheet.octopart.com/CL05A106MP8NUB8-Samsung-Electro-Mechanics-datasheet-141346815.pdf?src-supplier=Samsung+SCT; ComponentLink4URL: https://datasheet.octopart.com/CL05A106MP8NUB8-Samsung-Electro-Mechanics-datasheet-136460857.pdf?src-supplier=Future+Electronics; ComponentLink4Description: https://datasheet.octopart.com/CL05A106MP8NUB8-Samsung-Electro-Mechanics-datasheet-136460857.pdf?src-supplier=Future+Electronics; ComponentLink5URL: https://datasheet.octopart.com/CL05A106MP8NUB8-Samsung-Electro-Mechanics-datasheet-110326781.pdf?src-supplier=Future+Electronics; ComponentLink5Description: https://datasheet.octopart.com/CL05A106MP8NUB8-Samsung-Electro-Mechanics-datasheet-110326781.pdf?src-supplier=Future+Electronics; ComponentLink6URL: https://datasheet.octopart.com/CL05A106MP8NUB8-Samsung-Electro-Mechanics-datasheet-96443587.pdf?src-supplier=Future+Electronics; ComponentLink6Description: https://datasheet.octopart.com/CL05A106MP8NUB8-Samsung-Electro-Mechanics-datasheet-96443587.pdf?src-supplier=Future+Electronics; ComponentLink7URL: https://datasheet.octopart.com/CL05A106MP8NUB8-Samsung-Electro-Mechanics-datasheet-68297032.pdf?src-supplier=Future+Electronics; ComponentLink7Description: https://datasheet.octopart.com/CL05A106MP8NUB8-Samsung-Electro-Mechanics-datasheet-68297032.pdf?src-supplier=Future+Electronics; ComponentLink8URL: https://datasheet.octopart.com/CL05A106MP8NUB8-Samsung-Electro-Mechanics-datasheet-86032222.pdf?src-supplier=Future+Electronics; ComponentLink8Description: https://datasheet.octopart.com/CL05A106MP8NUB8-Samsung-Electro-Mechanics-datasheet-86032222.pdf?src-supplier=Future+Electronics; LCSC Part Number: C307415
C16 = CL05B104KB5NNNC: as C14 on sheet Scintillator_Circuit; Supplier: Avnet; Supplier Part Number: CL05B104KB5NNNC; Manufacturer Part Number: CL05B104KB5NNNC; RoHS: Yes; Category: Ceramic Capacitors; Pricing: 100000=0,00598, 120000=0,00595, 220000=0,00592, 500000=0,00589, 1000000=0,00586 (USD); Mounting Technology: Surface Mount; Pins: 2; Package Shape: Rectangular; Case/Package: 0402; Terminal Finish: Nickel; Min Operating Temperature: -55°C; Max Operating Temperature: 125°C; JESD-609 Code: e3; Capacitor Type: Ceramic; Packaging: Tape and Reel; Tolerance (fill in as +-): 10%; Rated DC Voltage (URdc): 50V; Temperature Characteristics Code: X7R; Termination: Wraparound; Reach SVHC Compliant: Yes; RoHS Compliant: Yes; ComponentLink1URL: https://datasheet.ciiva.com:443/pdfs/VipMasterIC/IC/SEMS/SEMS-S-A0008523115/SEMS-S-A0008523176-1.pdf?src-supplier=IHS+Markit; ComponentLink1Description: https://datasheet.ciiva.com:443/pdfs/VipMasterIC/IC/SEMS/SEMS-S-A0008523115/SEMS-S-A0008523176-1.pdf?src-supplier=IHS+Markit; ComponentLink2URL: https://datasheet.octopart.com/CL05B104KB5NNNC-Samsung-datasheet-97040617.pdf?src-supplier=Future+Electronics; ComponentLink2Description: https://datasheet.octopart.com/CL05B104KB5NNNC-Samsung-datasheet-97040617.pdf?src-supplier=Future+Electronics; ComponentLink3URL: https://datasheet.octopart.com/CL05B104KB5NNNC-Samsung-datasheet-8326407.pdf?src-supplier=TME; ComponentLink3Description: https://datasheet.octopart.com/CL05B104KB5NNNC-Samsung-datasheet-8326407.pdf?src-supplier=TME; LCSC Part Number: C960916
LS1 = PS1720P02: Data Line Filter, 1 Function(s); LCSC Part Number: C96061
SCREEN1 = LCD_TOUCHSCREEN: Data Line Filter, 1 Function(s); Manufacturer: TDK; Manufacturer Part Number: PS1720P02; Channels: 1; Supplier: Digikey; Supplier Part Number: 445-2527-ND; RoHS: Yes; Category: Buzzers; Stock: 1498; Pricing: 1=0,72, 10=0,587, 25=0,5404, 50=0,5082, 100=0,4777, 250=0,44032, 500=0,4141, 1500=0,37586, 6000=0,3365 (USD); Mounting Technology: Through Hole; Min Operating Temperature: -20°C; Max Operating Temperature: 70°C; Filter Type: DATA LINE FILTER; Packaging: Tape and Reel; Diameter: 17mm; Height: 8mm; Reach SVHC Compliant: Yes; RoHS Compliant: Yes; ComponentLink1URL: https://datasheet.ciiva.com:443/pdfs/VipMasterIC/IC/TDKC/TDKCS08938/TDKCS08938-1.pdf?src-supplier=IHS+Markit; ComponentLink1Description: https://datasheet.ciiva.com:443/pdfs/VipMasterIC/IC/TDKC/TDKCS08938/TDKCS08938-1.pdf?src-supplier=IHS+Markit; ComponentLink2URL: https://datasheet.ciiva.com/4625/ef532-ps-4625320.pdf?src-supplier=Mouser; ComponentLink2Description: https://datasheet.ciiva.com/4625/ef532-ps-4625320.pdf?src-supplier=Mouser; ComponentLink3URL: https://datasheet.ciiva.com/8113/ef532-ps-8113419.pdf?src-supplier=Avnet; ComponentLink3Description: https://datasheet.ciiva.com/8113/ef532-ps-8113419.pdf?src-supplier=Avnet; ComponentLink4URL: https://datasheet.ciiva.com/0/ef532-ps-122.pdf?src-supplier=Digikey; ComponentLink4Description: https://datasheet.ciiva.com/0/ef532-ps-122.pdf?src-supplier=Digikey; ComponentLink5URL: https://datasheet.ciiva.com/1/ef532-ps-1628.pdf?src-supplier=Digikey; ComponentLink5Description: https://datasheet.ciiva.com/1/ef532-ps-1628.pdf?src-supplier=Digikey; ComponentLink6URL: https://datasheet.ciiva.com/16225/ef532-ps-16225129.pdf?src-supplier=Onlinecomponents.com; ComponentLink6Description: https://datasheet.ciiva.com/16225/ef532-ps-16225129.pdf?src-supplier=Onlinecomponents.com; ComponentLink7URL: https://datasheet.ciiva.com/16477/ef532-ps-16477599.pdf?src-supplier=Future+Electronics; ComponentLink7Description: https://datasheet.ciiva.com/16477/ef532-ps-16477599.pdf?src-supplier=Future+Electronics